# EAGLE schematic Enclosure 100x68 Pi Base (EAGLE 9.6.2)
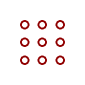
[diagram p0: schematic, sheet 1]

## Parts
U$1  PROTO-34X22-PI  [PROTO-34X22-PI]

## Library data of the parts
U$1 = digitalconcepts:PROTO-34X22-PI: 34 x 22 Prototyping board, with Raspberyr Pi Zero mount points, to fit an 100 x 68 enclosure